# EAGLE schematic Clock Extension (EAGLE 7.6.0)
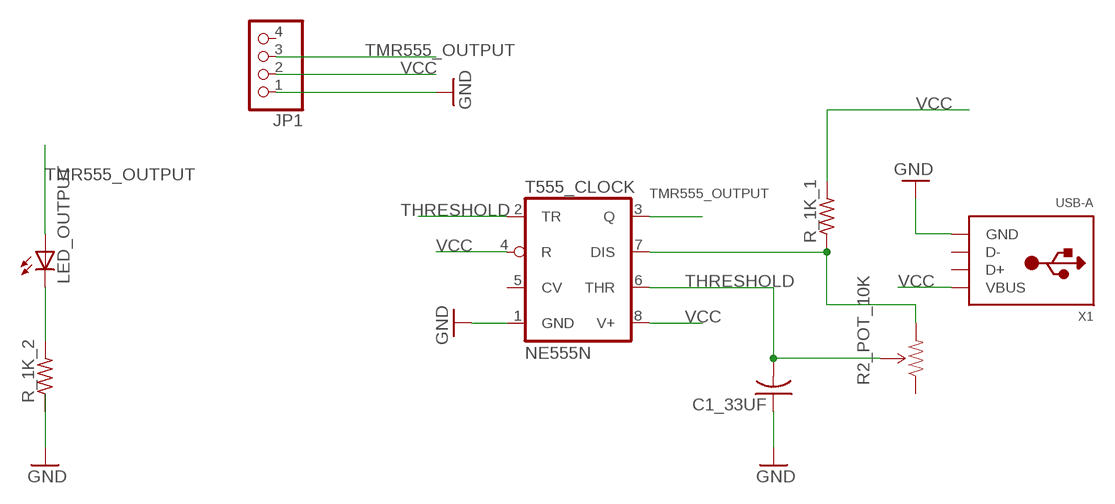
[diagram p0: schematic, sheet 1]

## Parts
C1_33UF  C-US025-030X050  [C025-030X050]
JP1  PINHD-1X4  [1X04]
LED_OUTPUT  LEDSMT1206  [1206]
R2_POT_10K  TRIMPOTPTH  [TRIM_POT_PTH]
R_1K_1  R-US_R1206  [R1206]
R_1K_2  R-US_R1206  [R1206]
T555_CLOCK  NE555N  [DIL08]
X1  USB-A  [MOLEX_480371000]

## Nets
GND: C1_33UF.1 JP1.1 R_1K_2.1 T555_CLOCK.1(GND) X1.4(GND)
N$1: R2_POT_10K.3(CW) R_1K_1.1 T555_CLOCK.7(DIS)
N$5: LED_OUTPUT.C R_1K_2.2
THRESHOLD: C1_33UF.2 R2_POT_10K.2(WIPER) T555_CLOCK.2(TR) T555_CLOCK.6(THR)
TMR555_OUTPUT: JP1.3 LED_OUTPUT.A T555_CLOCK.3(Q)
VCC: JP1.2 R_1K_1.2 T555_CLOCK.4(R) T555_CLOCK.8(V+) X1.1(VBUS)
Unconnected: JP1.4 R2_POT_10K.1(CCW) T555_CLOCK.5(CV) X1.2(D-) X1.3(D+)

## Library data of the parts
C1_33UF = adafruit:C-US: CAPACITOR, American symbol
JP1 = pinhead:PINHD-1X4: PIN HEADER
LED_OUTPUT = adafruit:LED: LED OSRAM: - CHIPLED LG R971, LG N971, LY N971, LG Q971, LY Q971, LO R971, LY R971 LH N974, LH R974 LS Q976, LO Q976, LY Q976 LO Q996 - Hyper CHIPLED LW Q18S LB Q993, LB Q99A, LB R99A - SideLED LS A670, LO A670, LY A670, LG A670, LP A670 LB A673, LV A673, LT A673, LW A673 LH A674 LY A675 LS A676, LA A676, LO A676, LY A676, LW A676 LS A679, LY A679, LG A679 - Hyper Micro SIDELED® LS Y876, LA Y876, LO Y876, LY Y876 LT Y87S - SmartLED LW L88C, LW L88S LB L89C, LB L89S, LG L890 LS L89K, LO L89K, LY L89K LS L896, LA L896, LO L896, LY L896 - TOPLED LS T670, LO T670, LY T670, LG T670, LP T670 LSG T670, LSP T670, LSY T670, LOP T670, LYG T670 LG T671, LOG T671, LSG T671 LB T673, LV T673, LT T673, LW T673 LH T674 LS T676, LA T676, LO T676, LY T676, LB T676, LH T676, LSB T676, LW T676 LB T67C, LV T67C, LT T67C, LS T67K, LO T67K, LY T67K, LW E67C LS E67B, LA E67B, LO E67B, LY E67B, LB E67C, LV E67C, LT E67C LW T67C LS T679, LY T679, LG T679 LS T770, LO T770, LY T770, LG T770, LP T770 LB T773, LV T773, LT T773, LW T773 LH T774 LS E675, LA E675, LY E675, LS T675 LS T776, LA T776, LO T776, LY T776, LB T776 LHGB T686 LT T68C, LB T68C - Hyper Mini TOPLED® LB M676 - Mini TOPLED Santana® LG M470 LS M47K, LO M47K, LY M47K Source: http://www.osram.convergy.de/
R2_POT_10K = SparkFun-Electromechanical:TRIMPOT: Various small potentiometers for "set-and-forget" applications
R_1K_1 R_1K_2 = adafruit:R-US_: RESISTOR, American symbol
T555_CLOCK = linear:*555: TIMER
X1 = adafruit:USB-A: USB type A 'plug' Used for things that can directly connect to a USB port, say USB key